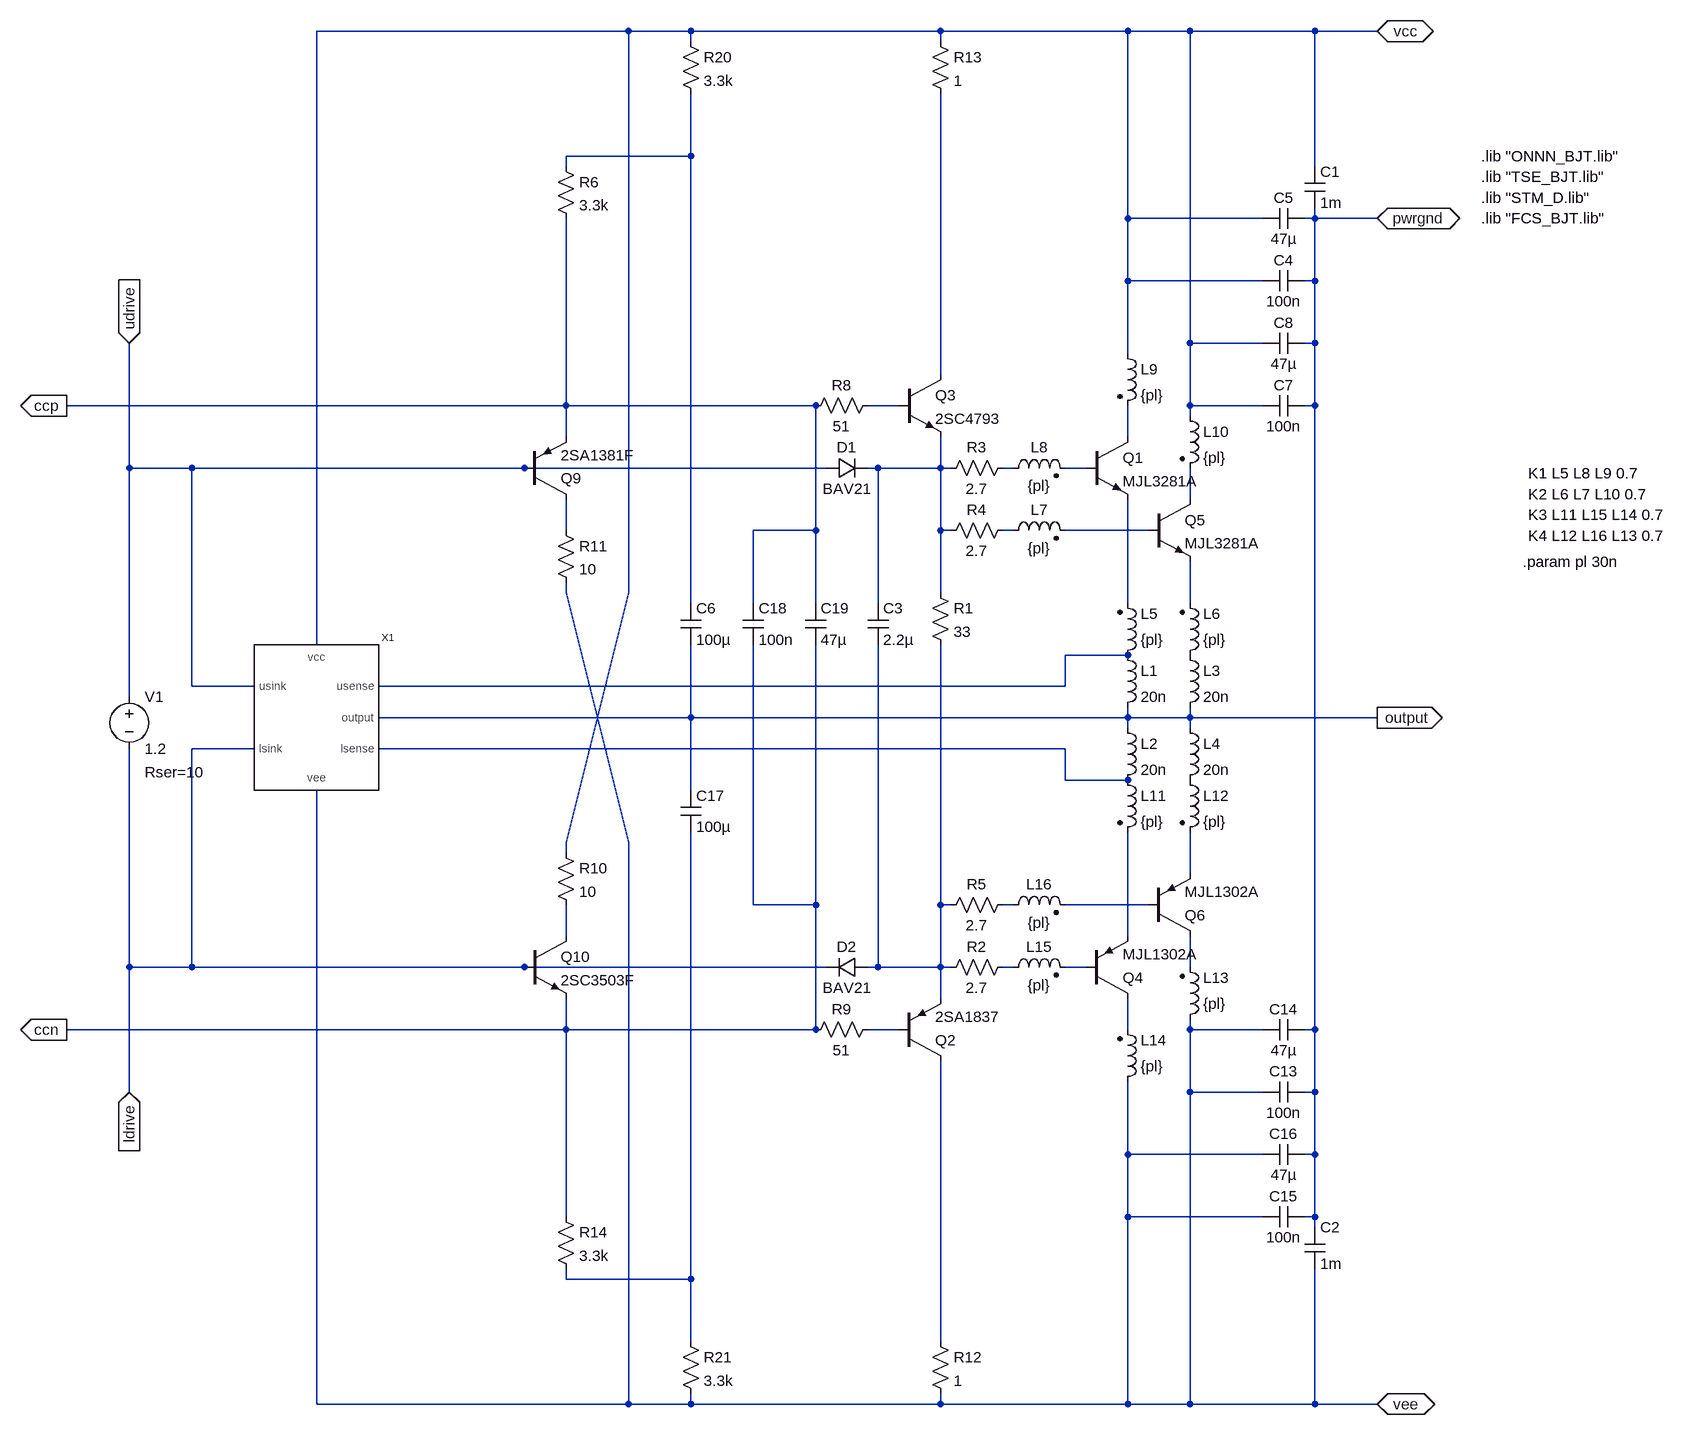
[diagram p0: schematic OPS_EFIII.asc]
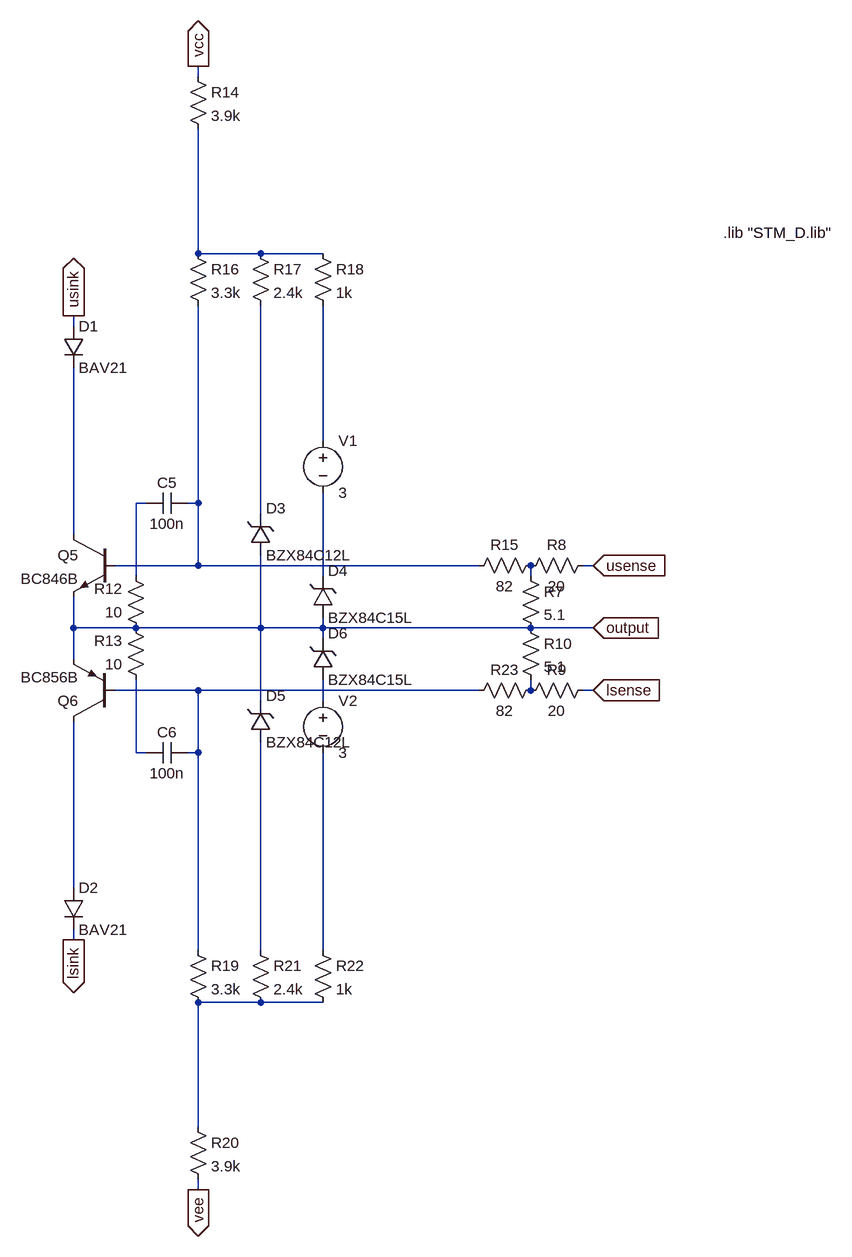
[diagram p1: sub-circuit viprotection.asc]
OPS_EFIII.asc, the LTspice schematic file:
Version 4
SHEET 1 3636 1368
WIRE 992 -896 512 -896
WIRE 1088 -896 992 -896
WIRE 1472 -896 1088 -896
WIRE 1760 -896 1472 -896
WIRE 1856 -896 1760 -896
WIRE 2048 -896 1856 -896
WIRE 2144 -896 2048 -896
WIRE 1088 -880 1088 -896
WIRE 1472 -880 1472 -896
WIRE 1760 -736 1760 -896
WIRE 1088 -704 1088 -800
WIRE 1088 -704 896 -704
WIRE 896 -688 896 -704
WIRE 2048 -688 2048 -896
WIRE 1760 -608 1760 -736
WIRE 1968 -608 1760 -608
WIRE 2048 -608 2048 -624
WIRE 2048 -608 2032 -608
WIRE 2144 -608 2048 -608
WIRE 1760 -512 1760 -608
WIRE 1968 -512 1760 -512
WIRE 2048 -512 2048 -608
WIRE 2048 -512 2032 -512
WIRE 1472 -432 1472 -800
WIRE 1856 -416 1856 -896
WIRE 1968 -416 1856 -416
WIRE 2048 -416 2048 -512
WIRE 2048 -416 2032 -416
WIRE 1760 -400 1760 -512
WIRE 1472 -368 1472 -432
WIRE 896 -320 896 -608
WIRE 896 -320 128 -320
WIRE 1280 -320 896 -320
WIRE 1408 -320 1360 -320
WIRE 1856 -320 1856 -416
WIRE 1968 -320 1856 -320
WIRE 2048 -320 2048 -416
WIRE 2048 -320 2032 -320
WIRE 1856 -304 1856 -320
WIRE 896 -272 896 -320
WIRE 1760 -272 1760 -320
WIRE 224 -224 224 -416
WIRE 320 -224 224 -224
WIRE 368 -224 320 -224
WIRE 832 -224 368 -224
WIRE 1296 -224 832 -224
WIRE 1376 -224 1360 -224
WIRE 1472 -224 1472 -272
WIRE 1472 -224 1376 -224
WIRE 1488 -224 1472 -224
WIRE 1584 -224 1568 -224
WIRE 1696 -224 1664 -224
WIRE 1856 -176 1856 -224
WIRE 896 -128 896 -176
WIRE 1280 -128 1280 -320
WIRE 1280 -128 1184 -128
WIRE 1472 -128 1472 -224
WIRE 1488 -128 1472 -128
WIRE 1584 -128 1568 -128
WIRE 1792 -128 1664 -128
WIRE 896 -32 896 -48
WIRE 992 -32 992 -896
WIRE 1472 -32 1472 -128
WIRE 1088 -16 1088 -704
WIRE 1184 -16 1184 -128
WIRE 1280 -16 1280 -128
WIRE 1376 -16 1376 -224
WIRE 1760 -16 1760 -176
WIRE 1856 -16 1856 -80
WIRE 512 48 512 -896
WIRE 1760 64 1664 64
WIRE 320 112 320 -224
WIRE 416 112 320 112
WIRE 1664 112 1664 64
WIRE 1664 112 608 112
WIRE 224 128 224 -224
WIRE 1088 160 1088 48
WIRE 1088 160 608 160
WIRE 1760 160 1760 144
WIRE 1760 160 1088 160
WIRE 1856 160 1856 144
WIRE 1856 160 1760 160
WIRE 2144 160 1856 160
WIRE 1760 176 1760 160
WIRE 1856 176 1856 160
WIRE 416 208 320 208
WIRE 1664 208 608 208
WIRE 1664 256 1664 208
WIRE 1760 256 1664 256
WIRE 1088 272 1088 160
WIRE 896 352 992 -32
WIRE 992 352 896 -32
WIRE 896 368 896 352
WIRE 1856 400 1856 336
WIRE 1184 448 1184 48
WIRE 1280 448 1280 48
WIRE 1280 448 1184 448
WIRE 1472 448 1472 48
WIRE 1488 448 1472 448
WIRE 1584 448 1568 448
WIRE 1792 448 1664 448
WIRE 896 496 896 448
WIRE 1760 496 1760 336
WIRE 224 544 224 208
WIRE 320 544 320 208
WIRE 320 544 224 544
WIRE 368 544 320 544
WIRE 832 544 368 544
WIRE 1296 544 832 544
WIRE 1376 544 1376 48
WIRE 1376 544 1360 544
WIRE 1472 544 1472 448
WIRE 1472 544 1376 544
WIRE 1488 544 1472 544
WIRE 1584 544 1568 544
WIRE 1696 544 1664 544
WIRE 1856 544 1856 496
WIRE 1472 592 1472 544
WIRE 896 640 896 592
WIRE 896 640 128 640
WIRE 1280 640 1280 448
WIRE 1280 640 896 640
WIRE 1408 640 1360 640
WIRE 1760 640 1760 592
WIRE 1856 640 1856 624
WIRE 1968 640 1856 640
WIRE 2048 640 2048 -320
WIRE 2048 640 2032 640
WIRE 224 736 224 544
WIRE 1856 736 1856 640
WIRE 1968 736 1856 736
WIRE 2048 736 2048 640
WIRE 2048 736 2032 736
WIRE 1760 832 1760 720
WIRE 1968 832 1760 832
WIRE 2048 832 2048 736
WIRE 2048 832 2032 832
WIRE 896 928 896 640
WIRE 1760 928 1760 832
WIRE 1968 928 1760 928
WIRE 2048 928 2048 832
WIRE 2048 928 2032 928
WIRE 2048 944 2048 928
WIRE 896 1024 896 1008
WIRE 1088 1024 1088 336
WIRE 1088 1024 896 1024
WIRE 1088 1120 1088 1024
WIRE 1472 1120 1472 688
WIRE 512 1216 512 272
WIRE 992 1216 992 352
WIRE 992 1216 512 1216
WIRE 1088 1216 1088 1200
WIRE 1088 1216 992 1216
WIRE 1472 1216 1472 1200
WIRE 1472 1216 1088 1216
WIRE 1760 1216 1760 928
WIRE 1760 1216 1472 1216
WIRE 1856 1216 1856 736
WIRE 1856 1216 1760 1216
WIRE 2048 1216 2048 1008
WIRE 2048 1216 1856 1216
WIRE 2144 1216 2048 1216
FLAG 2144 -896 vcc
IOPIN 2144 -896 BiDir
FLAG 2144 1216 vee
IOPIN 2144 1216 BiDir
FLAG 2144 160 output
IOPIN 2144 160 Out
FLAG 2144 -608 pwrgnd
IOPIN 2144 -608 BiDir
FLAG 224 -416 udrive
IOPIN 224 -416 In
FLAG 224 736 ldrive
IOPIN 224 736 In
FLAG 128 -320 ccp
IOPIN 128 -320 Out
FLAG 128 640 ccn
IOPIN 128 640 Out
DATAFLAG 1760 -736 "Ic(x2:Q1)"
DATAFLAG 368 -224 ""
DATAFLAG 368 544 ""
DATAFLAG 1472 -432 "Ic(x2:Q3)"
SYMBOL npn 1696 -272 R0
SYMATTR InstName Q1
SYMATTR Value MJL3281A
SYMBOL pnp 1408 688 M180
SYMATTR InstName Q2
SYMATTR Value 2SA1837
SYMBOL npn 1408 -368 R0
SYMATTR InstName Q3
SYMATTR Value 2SC4793
SYMBOL res 1456 -48 R0
SYMATTR InstName R1
SYMATTR Value 33
SYMBOL pnp 1696 592 M180
SYMATTR InstName Q4
SYMATTR Value MJL1302A
SYMBOL res 1584 528 R90
WINDOW 0 0 56 VBottom 2
WINDOW 3 32 56 VTop 2
SYMATTR InstName R2
SYMATTR Value 2.7
SYMBOL res 1584 -240 R90
WINDOW 0 0 56 VBottom 2
WINDOW 3 32 56 VTop 2
SYMATTR InstName R3
SYMATTR Value 2.7
SYMBOL cap 2032 -688 R0
SYMATTR InstName C1
SYMATTR Value 1m
SYMBOL cap 2032 1008 M180
WINDOW 0 24 64 Left 2
WINDOW 3 24 8 Left 2
SYMATTR InstName C2
SYMATTR Value 1m
SYMBOL cap 1968 -528 M90
WINDOW 0 0 32 VBottom 2
WINDOW 3 32 32 VTop 2
SYMATTR InstName C4
SYMATTR Value 100n
SYMBOL ind 1744 48 R0
SYMATTR InstName L1
SYMATTR Value 20n
SYMATTR SpiceLine Rser=220m Cpar=3p
SYMBOL ind 1744 160 R0
SYMATTR InstName L2
SYMATTR Value 20n
SYMATTR SpiceLine Rser=220m Cpar=3p
SYMBOL npn 1792 -176 R0
SYMATTR InstName Q5
SYMATTR Value MJL3281A
SYMBOL res 1584 -144 R90
WINDOW 0 0 56 VBottom 2
WINDOW 3 32 56 VTop 2
SYMATTR InstName R4
SYMATTR Value 2.7
SYMBOL ind 1840 48 R0
SYMATTR InstName L3
SYMATTR Value 20n
SYMATTR SpiceLine Rser=220m Cpar=3p
SYMBOL ind 1840 160 R0
SYMATTR InstName L4
SYMATTR Value 20n
SYMATTR SpiceLine Rser=220m Cpar=3p
SYMBOL pnp 1792 496 M180
SYMATTR InstName Q6
SYMATTR Value MJL1302A
SYMBOL res 1584 432 R90
WINDOW 0 0 56 VBottom 2
WINDOW 3 32 56 VTop 2
SYMATTR InstName R5
SYMATTR Value 2.7
SYMBOL cap 1968 -624 M90
WINDOW 0 0 32 VBottom 2
WINDOW 3 32 32 VTop 2
SYMATTR InstName C5
SYMATTR Value 47µ
SYMBOL res 1376 -336 R90
WINDOW 0 0 56 VBottom 2
WINDOW 3 32 56 VTop 2
SYMATTR InstName R8
SYMATTR Value 51
SYMBOL res 1376 624 R90
WINDOW 0 0 56 VBottom 2
WINDOW 3 32 56 VTop 2
SYMATTR InstName R9
SYMATTR Value 51
SYMBOL VIprotection 512 160 R0
SYMATTR InstName X1
SYMBOL cap 1968 -336 M90
WINDOW 0 0 32 VBottom 2
WINDOW 3 32 32 VTop 2
SYMATTR InstName C7
SYMATTR Value 100n
SYMBOL cap 1968 -432 M90
WINDOW 0 0 32 VBottom 2
WINDOW 3 32 32 VTop 2
SYMATTR InstName C8
SYMATTR Value 47µ
SYMBOL cap 1968 720 M90
WINDOW 0 0 32 VBottom 2
WINDOW 3 32 32 VTop 2
SYMATTR InstName C13
SYMATTR Value 100n
SYMBOL cap 1968 624 M90
WINDOW 0 0 32 VBottom 2
WINDOW 3 32 32 VTop 2
SYMATTR InstName C14
SYMATTR Value 47µ
SYMBOL cap 1968 912 M90
WINDOW 0 0 32 VBottom 2
WINDOW 3 32 32 VTop 2
SYMATTR InstName C15
SYMATTR Value 100n
SYMBOL cap 1968 816 M90
WINDOW 0 0 32 VBottom 2
WINDOW 3 32 32 VTop 2
SYMATTR InstName C16
SYMATTR Value 47µ
SYMBOL voltage 224 112 R0
WINDOW 123 0 0 Left 2
WINDOW 39 24 132 Left 2
SYMATTR SpiceLine Rser=10
SYMATTR InstName V1
SYMATTR Value 1.2
SYMBOL pnp 832 -176 M180
SYMATTR InstName Q9
SYMATTR Value 2SA1381F
SYMBOL res 880 352 R0
SYMATTR InstName R10
SYMATTR Value 10
SYMBOL res 880 -144 R0
SYMATTR InstName R11
SYMATTR Value 10
SYMBOL res 1456 1104 R0
SYMATTR InstName R12
SYMATTR Value 1
SYMBOL res 1456 -896 R0
SYMATTR InstName R13
SYMATTR Value 1
SYMBOL res 880 912 R0
SYMATTR InstName R14
SYMATTR Value 3.3k
SYMBOL npn 832 496 R0
SYMATTR InstName Q10
SYMATTR Value 2SC3503F
SYMBOL cap 1360 -16 R0
SYMATTR InstName C3
SYMATTR Value 2.2µ
SYMATTR SpiceLine Rser=56m Lser=17n Rpar=4meg Cpar=1p
SYMBOL res 1072 -896 R0
SYMATTR InstName R20
SYMATTR Value 3.3k
SYMBOL res 1072 1104 R0
SYMATTR InstName R21
SYMATTR Value 3.3k
SYMBOL cap 1264 -16 R0
SYMATTR InstName C19
SYMATTR Value 47µ
SYMATTR SpiceLine Rser=70m Lser=70n Rpar=1meg Cpar=1p
SYMBOL res 880 -704 R0
SYMATTR InstName R6
SYMATTR Value 3.3k
SYMBOL cap 1072 -16 R0
SYMATTR InstName C6
SYMATTR Value 100µ
SYMATTR SpiceLine Rser=70m Lser=50n Rpar=1meg Cpar=1p
SYMBOL cap 1072 272 R0
SYMATTR InstName C17
SYMATTR Value 100µ
SYMATTR SpiceLine Rser=70m Lser=50n Rpar=1meg Cpar=1p
SYMBOL cap 1168 -16 R0
SYMATTR InstName C18
SYMATTR Value 100n
SYMATTR SpiceLine Rser=156m Lser=17n Rpar=4meg Cpar=1p
SYMBOL diode 1296 -208 R270
WINDOW 0 32 32 VTop 2
WINDOW 3 0 32 VBottom 2
SYMATTR InstName D1
SYMATTR Value BAV21
SYMBOL diode 1360 560 M270
WINDOW 0 32 32 VTop 2
WINDOW 3 0 32 VBottom 2
SYMATTR InstName D2
SYMATTR Value BAV21
SYMBOL ind2 1744 80 M180
WINDOW 0 36 80 Left 2
WINDOW 3 36 40 Left 2
SYMATTR InstName L5
SYMATTR Value {pl}
SYMATTR SpiceLine Rser=10m
SYMBOL ind2 1840 80 M180
WINDOW 0 36 80 Left 2
WINDOW 3 36 40 Left 2
SYMATTR InstName L6
SYMATTR Value {pl}
SYMATTR SpiceLine Rser=10m
SYMBOL ind2 1568 -112 R270
WINDOW 0 32 56 VTop 2
WINDOW 3 4 56 VBottom 2
SYMATTR InstName L7
SYMATTR Value {pl}
SYMATTR SpiceLine Rser=10m
SYMBOL ind2 1568 -208 R270
WINDOW 0 32 56 VTop 2
WINDOW 3 4 56 VBottom 2
SYMATTR InstName L8
SYMATTR Value {pl}
SYMATTR SpiceLine Rser=10m
SYMBOL ind2 1744 -416 R0
SYMATTR InstName L9
SYMATTR Value {pl}
SYMATTR SpiceLine Rser=10m
SYMBOL ind2 1840 -320 R0
SYMATTR InstName L10
SYMATTR Value {pl}
SYMATTR SpiceLine Rser=10m
SYMBOL ind2 1744 240 R0
SYMATTR InstName L11
SYMATTR Value {pl}
SYMATTR SpiceLine Rser=10m
SYMBOL ind2 1840 240 R0
SYMATTR InstName L12
SYMATTR Value {pl}
SYMATTR SpiceLine Rser=10m
SYMBOL ind2 1840 640 M180
WINDOW 0 36 80 Left 2
WINDOW 3 36 40 Left 2
SYMATTR InstName L13
SYMATTR Value {pl}
SYMATTR SpiceLine Rser=10m
SYMBOL ind2 1744 736 M180
WINDOW 0 36 80 Left 2
WINDOW 3 36 40 Left 2
SYMATTR InstName L14
SYMATTR Value {pl}
SYMATTR SpiceLine Rser=10m
SYMBOL ind2 1568 560 R270
WINDOW 0 32 56 VTop 2
WINDOW 3 4 56 VBottom 2
SYMATTR InstName L15
SYMATTR Value {pl}
SYMATTR SpiceLine Rser=10m
SYMBOL ind2 1568 464 R270
WINDOW 0 32 56 VTop 2
WINDOW 3 4 56 VBottom 2
SYMATTR InstName L16
SYMATTR Value {pl}
SYMATTR SpiceLine Rser=10m
TEXT 2304 -704 Left 2 !.lib "ONNN_BJT.lib"
TEXT 2304 -672 Left 2 !.lib "TSE_BJT.lib"
TEXT 2304 -640 Left 2 !.lib "STM_D.lib"
TEXT 2304 -608 Left 2 !.lib "FCS_BJT.lib"
TEXT 2376 -216 Left 2 !K1 L5 L8 L9 0.7
TEXT 2376 -184 Left 2 !K2 L6 L7 L10 0.7
TEXT 2376 -152 Left 2 !K3 L11 L15 L14 0.7
TEXT 2376 -120 Left 2 !K4 L12 L16 L13 0.7
TEXT 2368 -80 Left 2 !.param pl 30n

viprotection.asc, the sub-circuit schematic file:
Version 4
SHEET 1 1904 680
WIRE -288 -1488 -288 -1504
WIRE -288 -1216 -288 -1408
WIRE -192 -1216 -288 -1216
WIRE -96 -1216 -192 -1216
WIRE -480 -1104 -480 -1120
WIRE -96 -928 -96 -1136
WIRE -368 -832 -384 -832
WIRE -288 -832 -288 -1136
WIRE -288 -832 -304 -832
WIRE -192 -816 -192 -1136
WIRE -480 -784 -480 -1040
WIRE -288 -736 -288 -832
WIRE -288 -736 -416 -736
WIRE 144 -736 -288 -736
WIRE 320 -736 304 -736
WIRE -384 -720 -384 -832
WIRE -96 -720 -96 -848
WIRE 224 -720 224 -736
WIRE -480 -640 -480 -688
WIRE -384 -640 -480 -640
WIRE -192 -640 -192 -752
WIRE -192 -640 -384 -640
WIRE -96 -640 -96 -656
WIRE -96 -640 -192 -640
WIRE 224 -640 -96 -640
WIRE 320 -640 224 -640
WIRE -96 -624 -96 -640
WIRE -480 -592 -480 -640
WIRE -288 -544 -416 -544
WIRE 144 -544 -288 -544
WIRE 224 -544 224 -560
WIRE 320 -544 304 -544
WIRE -192 -528 -192 -640
WIRE -96 -528 -96 -560
WIRE -384 -448 -384 -560
WIRE -368 -448 -384 -448
WIRE -288 -448 -288 -544
WIRE -288 -448 -304 -448
WIRE -480 -240 -480 -496
WIRE -480 -160 -480 -176
WIRE -288 -144 -288 -448
WIRE -192 -144 -192 -464
WIRE -96 -144 -96 -448
WIRE -192 -64 -288 -64
WIRE -96 -64 -192 -64
WIRE -288 128 -288 -64
WIRE -288 224 -288 208
FLAG -288 -1504 vcc
IOPIN -288 -1504 Out
FLAG -288 224 vee
IOPIN -288 224 Out
FLAG 320 -736 usense
IOPIN 320 -736 In
FLAG 320 -544 lsense
IOPIN 320 -544 In
FLAG 320 -640 output
IOPIN 320 -640 In
FLAG -480 -1120 usink
IOPIN -480 -1120 Out
FLAG -480 -160 lsink
IOPIN -480 -160 Out
SYMBOL npn -416 -784 M0
SYMATTR InstName Q5
SYMATTR Value BC846B
SYMBOL diode -496 -1104 R0
SYMATTR InstName D1
SYMATTR Value BAV21
SYMBOL res 208 -736 R0
SYMATTR InstName R7
SYMATTR Value 5.1
SYMBOL res 320 -752 R90
WINDOW 0 0 56 VBottom 0
WINDOW 3 32 56 VTop 0
SYMATTR InstName R8
SYMATTR Value 20
SYMBOL pnp -416 -496 R180
SYMATTR InstName Q6
SYMATTR Value BC856B
SYMBOL diode -496 -240 R0
SYMATTR InstName D2
SYMATTR Value BAV21
SYMBOL res 320 -560 R90
WINDOW 0 0 56 VBottom 0
WINDOW 3 32 56 VTop 0
SYMATTR InstName R9
SYMATTR Value 20
SYMBOL res 208 -656 R0
SYMATTR InstName R10
SYMATTR Value 5.1
SYMBOL res -368 -624 R180
WINDOW 0 36 76 Left 0
WINDOW 3 36 40 Left 0
SYMATTR InstName R12
SYMATTR Value 10
SYMBOL cap -304 -848 R90
WINDOW 0 0 32 VBottom 0
WINDOW 3 32 32 VTop 0
SYMATTR InstName C5
SYMATTR Value 100n
SYMBOL cap -304 -464 R90
WINDOW 0 0 32 VBottom 0
WINDOW 3 32 32 VTop 0
SYMATTR InstName C6
SYMATTR Value 100n
SYMBOL res -368 -544 R180
WINDOW 0 36 76 Left 0
WINDOW 3 36 40 Left 0
SYMATTR InstName R13
SYMATTR Value 10
SYMBOL res -304 -1504 R0
SYMATTR InstName R14
SYMATTR Value 3.9k
SYMBOL res 240 -752 R90
WINDOW 0 0 56 VBottom 0
WINDOW 3 32 56 VTop 0
SYMATTR InstName R15
SYMATTR Value 82
SYMBOL res -304 -1232 R0
SYMATTR InstName R16
SYMATTR Value 3.3k
SYMBOL zener -208 -752 M180
WINDOW 0 24 72 Left 0
WINDOW 3 24 0 Left 0
SYMATTR InstName D3
SYMATTR Value BZX84C12L
SYMATTR Description Diode
SYMATTR Type diode
SYMBOL zener -112 -656 M180
WINDOW 0 24 72 Left 0
WINDOW 3 24 0 Left 0
SYMATTR InstName D4
SYMATTR Value BZX84C15L
SYMATTR Description Diode
SYMATTR Type diode
SYMBOL res -208 -1232 R0
SYMATTR InstName R17
SYMATTR Value 2.4k
SYMBOL res -112 -1232 R0
SYMATTR InstName R18
SYMATTR Value 1k
SYMBOL res -304 -160 R0
SYMATTR InstName R19
SYMATTR Value 3.3k
SYMBOL res -304 112 R0
SYMATTR InstName R20
SYMATTR Value 3.9k
SYMBOL zener -208 -464 M180
WINDOW 0 24 72 Left 0
WINDOW 3 24 0 Left 0
SYMATTR InstName D5
SYMATTR Value BZX84C12L
SYMATTR Description Diode
SYMATTR Type diode
SYMBOL zener -112 -560 M180
WINDOW 0 24 72 Left 0
WINDOW 3 24 0 Left 0
SYMATTR InstName D6
SYMATTR Value BZX84C15L
SYMATTR Description Diode
SYMATTR Type diode
SYMBOL res -208 -160 R0
SYMATTR InstName R21
SYMATTR Value 2.4k
SYMBOL res -112 -160 R0
SYMATTR InstName R22
SYMATTR Value 1k
SYMBOL res 240 -560 R90
WINDOW 0 0 56 VBottom 0
WINDOW 3 32 56 VTop 0
SYMATTR InstName R23
SYMATTR Value 82
SYMBOL voltage -96 -944 R0
WINDOW 123 0 0 Left 0
WINDOW 39 0 0 Left 0
SYMATTR InstName V1
SYMATTR Value 3
SYMBOL voltage -96 -544 R0
WINDOW 123 0 0 Left 0
WINDOW 39 0 0 Left 0
SYMATTR InstName V2
SYMATTR Value 3
TEXT 520 -1248 Left 0 !.lib "STM_D.lib"

The netlist it stands for:
* OPS_EFIII.asc
Q1 N004 N007 N012 0 MJL3281A
Q2 N028 N025 N017 0 2SA1837
Q3 N002 N003 N005 0 2SC4793
R1 N005 N017 33
Q4 N026 N023 N021 0 MJL1302A
R2 N022 N017 2.7
R3 N006 N005 2.7
C1 vcc pwrgnd 1m
C2 vee pwrgnd 1m
C4 vcc pwrgnd 100n
L1 N014 output 20n Rser=220m Cpar=3p
L2 output N015 20n Rser=220m Cpar=3p
Q5 N008 N011 N013 0 MJL3281A
R4 N010 N005 2.7
L3 P001 output 20n Rser=220m Cpar=3p
L4 output P002 20n Rser=220m Cpar=3p
Q6 N024 N019 N016 0 MJL1302A
R5 N018 N017 2.7
C5 vcc pwrgnd 47µ
R8 N003 ccp 51
R9 N025 ccn 51
XX1 vcc vee N014 N015 udrive ldrive output viprotection
C7 vcc pwrgnd 100n
C8 vcc pwrgnd 47µ
C13 vee pwrgnd 100n
C14 vee pwrgnd 47µ
C15 vee pwrgnd 100n
C16 vee pwrgnd 47µ
V1 udrive ldrive 1.2 Rser=10
Q9 N009 udrive ccp 0 2SA1381F
R10 vcc N020 10
R11 N009 vee 10
R12 N028 vee 1
R13 vcc N002 1
R14 ccn N027 3.3k
Q10 N020 ldrive ccn 0 2SC3503F
C3 N005 N017 2.2µ Rser=56m Lser=17n Rpar=4meg Cpar=1p
R20 vcc N001 3.3k
R21 N027 vee 3.3k
C19 ccp ccn 47µ Rser=70m Lser=70n Rpar=1meg Cpar=1p
R6 N001 ccp 3.3k
C6 N001 output 100µ Rser=70m Lser=50n Rpar=1meg Cpar=1p
C17 output N027 100µ Rser=70m Lser=50n Rpar=1meg Cpar=1p
C18 ccp ccn 100n Rser=156m Lser=17n Rpar=4meg Cpar=1p
D1 udrive N005 BAV21
D2 N017 ldrive BAV21
L5 N014 N012 {pl} Rser=10m
L6 P001 N013 {pl} Rser=10m
L7 N010 N011 {pl} Rser=10m
L8 N006 N007 {pl} Rser=10m
L9 vcc N004 {pl} Rser=10m
L10 vcc N008 {pl} Rser=10m
L11 N015 N021 {pl} Rser=10m
L12 P002 N016 {pl} Rser=10m
L13 vee N024 {pl} Rser=10m
L14 vee N026 {pl} Rser=10m
L15 N022 N023 {pl} Rser=10m
L16 N018 N019 {pl} Rser=10m

* block symbol definitions
.subckt viprotection vcc vee usense lsense usink lsink output
Q5 N006 N004 output 0 BC846B
D1 usink N006 BAV21
R7 N008 output 5.1
R8 usense N008 20
Q6 N013 N009 output 0 BC856B
D2 N013 lsink BAV21
R9 lsense N010 20
R10 output N010 5.1
R12 output N003 10
C5 N004 N003 100n
C6 N009 N012 100n
R13 N012 output 10
R14 vcc N001 3.9k
R15 N008 N004 82
R16 N001 N004 3.3k
D3 output N005 BZX84C12L
D4 output N007 BZX84C15L
R17 N001 N005 2.4k
R18 N001 N002 1k
R19 N009 N016 3.3k
R20 N016 vee 3.9k
D5 N014 output BZX84C12L
D6 N011 output BZX84C15L
R21 N014 N016 2.4k
R22 N015 N016 1k
R23 N010 N009 82
V1 N002 N007 3
V2 N011 N015 3
.lib "STM_D.lib"
.ends viprotection

.model D D
.lib standard.dio
.model NPN NPN
.model PNP PNP
.lib standard.bjt
.lib "ONNN_BJT.lib"
.lib "TSE_BJT.lib"
.lib "STM_D.lib"
.lib "FCS_BJT.lib"
K1 L5 L8 L9 0.7
K2 L6 L7 L10 0.7
K3 L11 L15 L14 0.7
K4 L12 L16 L13 0.7
.param pl 30n
.backanno
.end